# EAGLE schematic micro_motor (EAGLE 9.0.1)
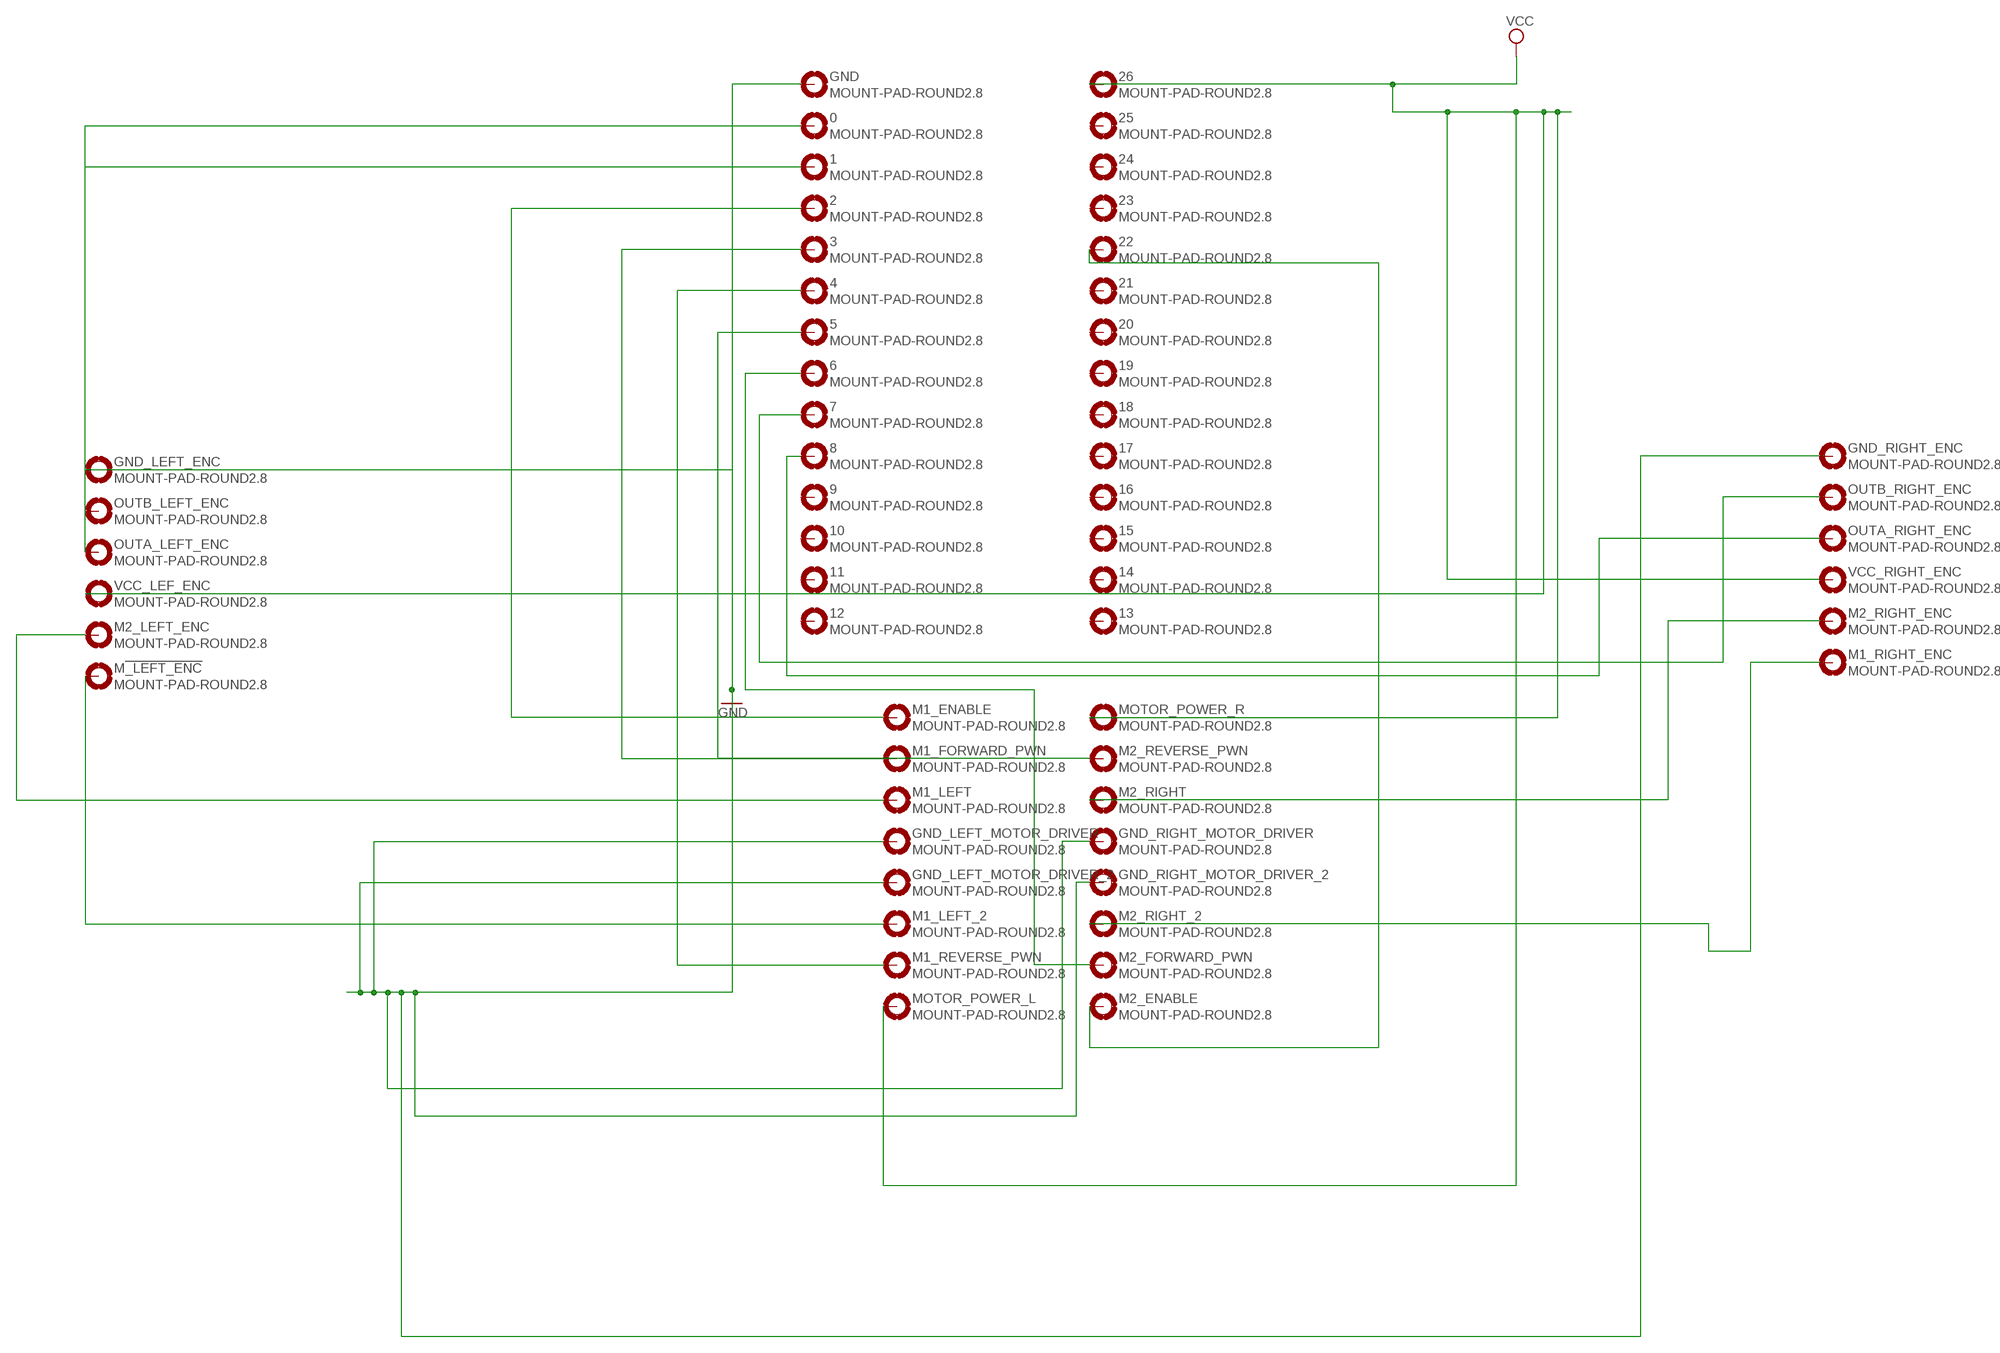
[diagram p0: schematic, sheet 1]

## Parts
0  MOUNT-PAD-ROUND2.8  [2,8-PAD]
1  MOUNT-PAD-ROUND2.8  [2,8-PAD]
2  MOUNT-PAD-ROUND2.8  [2,8-PAD]
3  MOUNT-PAD-ROUND2.8  [2,8-PAD]
4  MOUNT-PAD-ROUND2.8  [2,8-PAD]
5  MOUNT-PAD-ROUND2.8  [2,8-PAD]
6  MOUNT-PAD-ROUND2.8  [2,8-PAD]
7  MOUNT-PAD-ROUND2.8  [2,8-PAD]
8  MOUNT-PAD-ROUND2.8  [2,8-PAD]
9  MOUNT-PAD-ROUND2.8  [2,8-PAD]
10  MOUNT-PAD-ROUND2.8  [2,8-PAD]
11  MOUNT-PAD-ROUND2.8  [2,8-PAD]
12  MOUNT-PAD-ROUND2.8  [2,8-PAD]
13  MOUNT-PAD-ROUND2.8  [2,8-PAD]
14  MOUNT-PAD-ROUND2.8  [2,8-PAD]
15  MOUNT-PAD-ROUND2.8  [2,8-PAD]
16  MOUNT-PAD-ROUND2.8  [2,8-PAD]
17  MOUNT-PAD-ROUND2.8  [2,8-PAD]
18  MOUNT-PAD-ROUND2.8  [2,8-PAD]
19  MOUNT-PAD-ROUND2.8  [2,8-PAD]
20  MOUNT-PAD-ROUND2.8  [2,8-PAD]
21  MOUNT-PAD-ROUND2.8  [2,8-PAD]
22  MOUNT-PAD-ROUND2.8  [2,8-PAD]
23  MOUNT-PAD-ROUND2.8  [2,8-PAD]
24  MOUNT-PAD-ROUND2.8  [2,8-PAD]
25  MOUNT-PAD-ROUND2.8  [2,8-PAD]
26  MOUNT-PAD-ROUND2.8  [2,8-PAD]
GND  MOUNT-PAD-ROUND2.8  [2,8-PAD]
GND_LEFT_ENC  MOUNT-PAD-ROUND2.8  [2,8-PAD]
GND_LEFT_MOTOR_DRIVER  MOUNT-PAD-ROUND2.8  [2,8-PAD]
GND_LEFT_MOTOR_DRIVER_2  MOUNT-PAD-ROUND2.8  [2,8-PAD]
GND_RIGHT_ENC  MOUNT-PAD-ROUND2.8  [2,8-PAD]
GND_RIGHT_MOTOR_DRIVER  MOUNT-PAD-ROUND2.8  [2,8-PAD]
GND_RIGHT_MOTOR_DRIVER_2  MOUNT-PAD-ROUND2.8  [2,8-PAD]
M1_ENABLE  MOUNT-PAD-ROUND2.8  [2,8-PAD]
M1_FORWARD_PWN  MOUNT-PAD-ROUND2.8  [2,8-PAD]
M1_LEFT  MOUNT-PAD-ROUND2.8  [2,8-PAD]
M1_LEFT_2  MOUNT-PAD-ROUND2.8  [2,8-PAD]
M1_REVERSE_PWN  MOUNT-PAD-ROUND2.8  [2,8-PAD]
M1_RIGHT_ENC  MOUNT-PAD-ROUND2.8  [2,8-PAD]
M2_ENABLE  MOUNT-PAD-ROUND2.8  [2,8-PAD]
M2_FORWARD_PWN  MOUNT-PAD-ROUND2.8  [2,8-PAD]
M2_LEFT_ENC  MOUNT-PAD-ROUND2.8  [2,8-PAD]
M2_REVERSE_PWN  MOUNT-PAD-ROUND2.8  [2,8-PAD]
M2_RIGHT  MOUNT-PAD-ROUND2.8  [2,8-PAD]
M2_RIGHT_2  MOUNT-PAD-ROUND2.8  [2,8-PAD]
M2_RIGHT_ENC  MOUNT-PAD-ROUND2.8  [2,8-PAD]
M!_LEFT_ENC  MOUNT-PAD-ROUND2.8  [2,8-PAD]
MOTOR_POWER_L  MOUNT-PAD-ROUND2.8  [2,8-PAD]
MOTOR_POWER_R  MOUNT-PAD-ROUND2.8  [2,8-PAD]
OUTA_LEFT_ENC  MOUNT-PAD-ROUND2.8  [2,8-PAD]
OUTA_RIGHT_ENC  MOUNT-PAD-ROUND2.8  [2,8-PAD]
OUTB_LEFT_ENC  MOUNT-PAD-ROUND2.8  [2,8-PAD]
OUTB_RIGHT_ENC  MOUNT-PAD-ROUND2.8  [2,8-PAD]
VCC_LEF_ENC  MOUNT-PAD-ROUND2.8  [2,8-PAD]
VCC_RIGHT_ENC  MOUNT-PAD-ROUND2.8  [2,8-PAD]

## Nets
GND: GND.B2,8(MOUNT) GND_LEFT_ENC.B2,8(MOUNT) GND_LEFT_MOTOR_DRIVER.B2,8(MOUNT) GND_LEFT_MOTOR_DRIVER_2.B2,8(MOUNT) GND_RIGHT_ENC.B2,8(MOUNT) GND_RIGHT_MOTOR_DRIVER.B2,8(MOUNT) GND_RIGHT_MOTOR_DRIVER_2.B2,8(MOUNT)
N$1: 0.B2,8(MOUNT) OUTB_LEFT_ENC.B2,8(MOUNT)
N$2: 1.B2,8(MOUNT) OUTA_LEFT_ENC.B2,8(MOUNT)
N$3: M1_LEFT.B2,8(MOUNT) M2_LEFT_ENC.B2,8(MOUNT)
N$4: 3.B2,8(MOUNT) M1_FORWARD_PWN.B2,8(MOUNT)
N$5: 4.B2,8(MOUNT) M1_REVERSE_PWN.B2,8(MOUNT)
N$6: 2.B2,8(MOUNT) M1_ENABLE.B2,8(MOUNT)
N$7: 8.B2,8(MOUNT) OUTA_RIGHT_ENC.B2,8(MOUNT)
N$8: M2_RIGHT.B2,8(MOUNT) M2_RIGHT_ENC.B2,8(MOUNT)
N$9: 7.B2,8(MOUNT) OUTB_RIGHT_ENC.B2,8(MOUNT)
N$10: M1_RIGHT_ENC.B2,8(MOUNT) M2_RIGHT_2.B2,8(MOUNT)
N$11: M1_LEFT_2.B2,8(MOUNT) M!_LEFT_ENC.B2,8(MOUNT)
N$12: 5.B2,8(MOUNT) M2_REVERSE_PWN.B2,8(MOUNT)
N$13: 22.B2,8(MOUNT) M2_ENABLE.B2,8(MOUNT)
N$14: 6.B2,8(MOUNT) M2_FORWARD_PWN.B2,8(MOUNT)
VCC: 26.B2,8(MOUNT) MOTOR_POWER_L.B2,8(MOUNT) MOTOR_POWER_R.B2,8(MOUNT) VCC_LEF_ENC.B2,8(MOUNT) VCC_RIGHT_ENC.B2,8(MOUNT)
Unconnected: 9.B2,8(MOUNT) 10.B2,8(MOUNT) 11.B2,8(MOUNT) 12.B2,8(MOUNT) 13.B2,8(MOUNT) 14.B2,8(MOUNT) 15.B2,8(MOUNT) 16.B2,8(MOUNT) 17.B2,8(MOUNT) 18.B2,8(MOUNT) 19.B2,8(MOUNT) 20.B2,8(MOUNT) 21.B2,8(MOUNT) 23.B2,8(MOUNT) 24.B2,8(MOUNT) 25.B2,8(MOUNT)

## Library data of the parts
0 1-26 GND GND_LEFT_ENC GND_LEFT_MOTOR_DRIVER GND_LEFT_MOTOR_DRIVER_2 GND_RIGHT_ENC GND_RIGHT_MOTOR_DRIVER GND_RIGHT_MOTOR_DRIVER_2 M1_ENABLE M1_FORWARD_PWN M1_LEFT M1_LEFT_2 M1_REVERSE_PWN M1_RIGHT_ENC M2_ENABLE M2_FORWARD_PWN M2_LEFT_ENC M2_REVERSE_PWN M2_RIGHT M2_RIGHT_2 M2_RIGHT_ENC M!_LEFT_ENC MOTOR_POWER_L MOTOR_POWER_R OUTA_LEFT_ENC OUTA_RIGHT_ENC OUTB_LEFT_ENC OUTB_RIGHT_ENC VCC_LEF_ENC VCC_RIGHT_ENC = holes:MOUNT-PAD-ROUND: MOUNTING PAD, round